# Altium schematic sheet MicroControllerSTM32f103.SchDoc
size A4
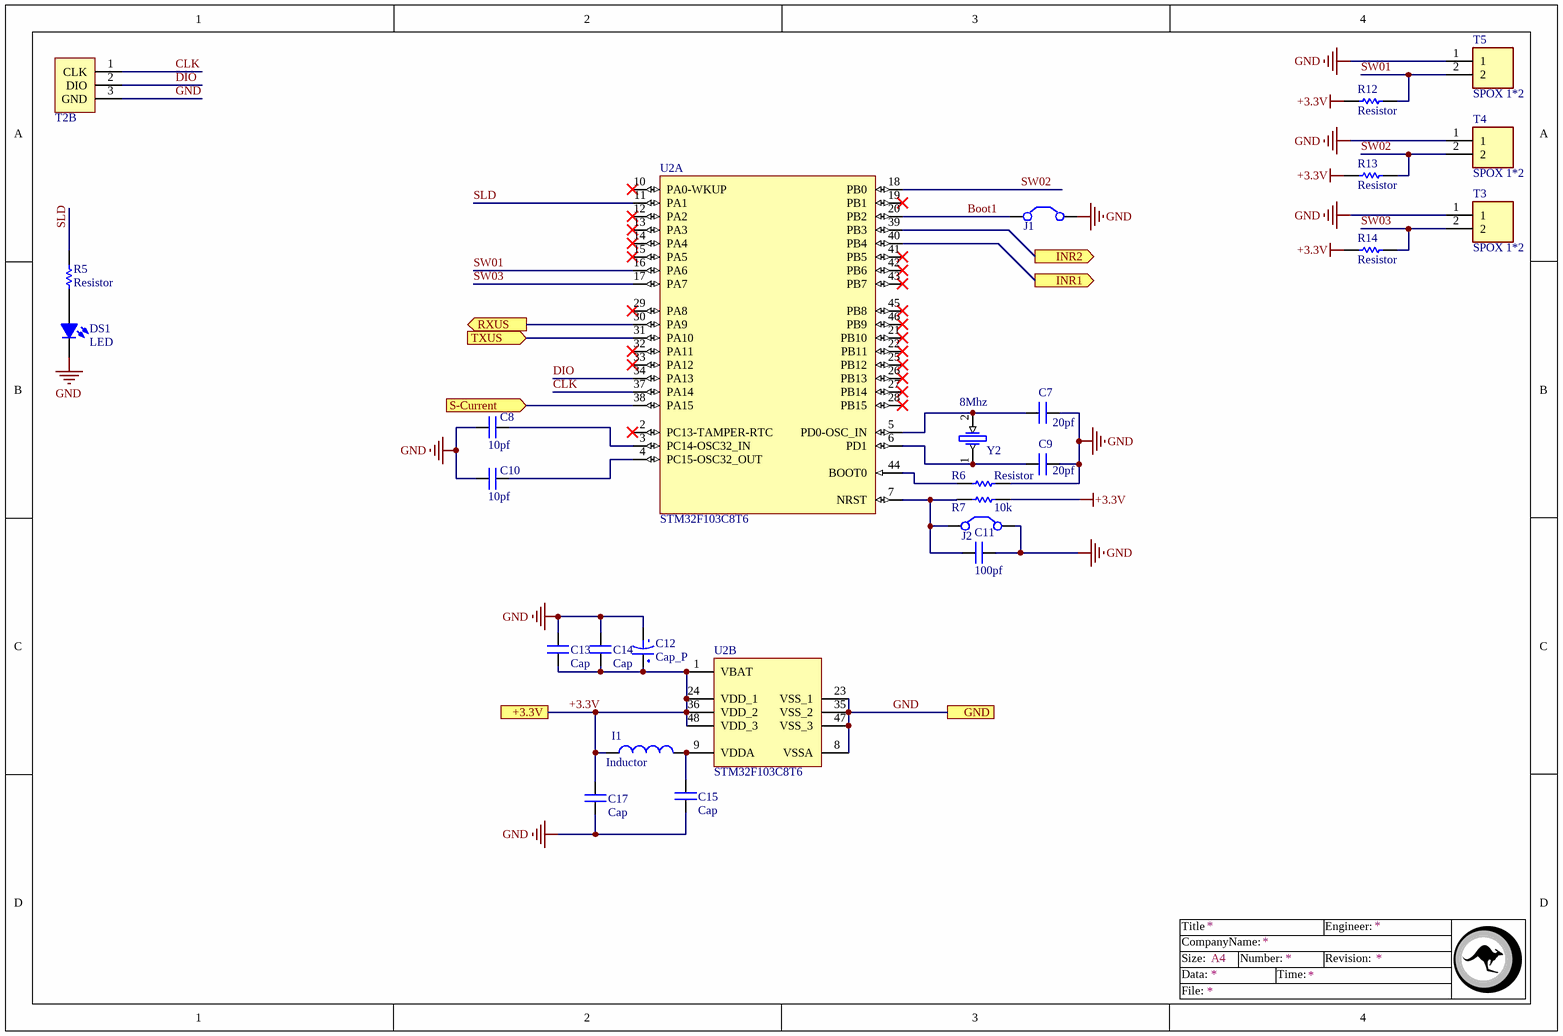
[diagram p0: MicroControllerSTM32f103.SchDoc]

## Parts
C7  20pf  [Cap0805]
C8  10pf  [Cap0805]
C9  20pf  [Cap0805]
C10  10pf  [Cap0805]
C11  100pf  [Cap0805]
C12  Cap_P  [CAPMOL_C]
C13  Cap  [Cap0805]
C14  Cap  [Cap0805]
C15  Cap  [Cap0805]
C17  Cap  [Cap0805]
DS1  LED  [Led0805]
I1  Inductor  [1206]
J1  Jumper  [Jumper SMD - Small]  (value not drawn)
J2  Jumper  [Jumper SMD - Small]  (value not drawn)
R5  Resistor  [R0805]
R6  Resistor  [R0805]
R7  10k  [R0805]
R12  Resistor  [0603]
R13  Resistor  [0603]
R14  Resistor  [0603]
T2  Serial Program  [MHDR1X03-254P - E]  (value not drawn)  (part B of 2)
T3  SPOX 1*2  [SPOX2]
T4  SPOX 1*2  [SPOX2]
T5  SPOX 1*2  [SPOX2]
U2  STM32F103C8T6  [LQFP48_L]  (parts A,B of 2)
Y2  8Mhz  [CrystallB]

## Ports
+3.3V, GND, INR1 (out), INR2 (out), RXUS (out), S-Current (in), TXUS (in)

## Nets
+3.3V: C12.2 C13.1 C14.1 C17.2 I1.1 R7.1 R12.1 R13.1 R14.1 U2.1(VBAT) U2.24(VDD_1) U2.36(VDD_2) U2.48(VDD_3) ; port +3.3V
GND: C7.1 C8.1 C9.1 C10.1 C11.2 C12.1 C13.2 C14.2 C15.1 C17.1 DS1.K J1.2(C2) J2.2(C2) R6.2 T2.3(GND) T3.1 T4.1 T5.1 U2.8(VSSA) U2.23(VSS_1) U2.35(VSS_2) U2.47(VSS_3) ; port GND
Boot1: J1.1(C1) U2.20(PB2)
CLK: T2.1(CLK) U2.37(PA14)
DIO: T2.2(DIO) U2.34(PA13)
INR1: U2.40(PB4) ; port INR1
INR2: U2.39(PB3) ; port INR2
RXUS: U2.30(PA9) ; port RXUS
S-Current: U2.38(PA15) ; port S-Current
SLD: R5.1 U2.11(PA1)
SW01: R12.2 T5.2 U2.16(PA6)
SW02: R13.2 T4.2 U2.18(PB0)
SW03: R14.2 T3.2 U2.17(PA7)
TXUS: U2.31(PA10) ; port TXUS
NetC7_2: C7.2 U2.5(PD0-OSC_IN) Y2.2
NetC8_2: C8.2 U2.3(PC14-OSC32_IN)
NetC9_2: C9.2 U2.6(PD1) Y2.1
NetC10_2: C10.2 U2.4(PC15-OSC32_OUT)
NetC11_1: C11.1 J2.1(C1) R7.2 U2.7(NRST)
NetC15_2: C15.2 I1.2 U2.9(VDDA)
NetDS1_A: DS1.A R5.2
NetR6_1: R6.1 U2.44(BOOT0)

Not connected (* = marked no-connect by the designer): U2 2(PC13-TAMPER-RTC)* 10(PA0-WKUP)* 12(PA2)* 13(PA3)* 14(PA4)* 15(PA5)* 19(PB1)* 21(PB10)* 22(PB11)* 25(PB12)* 26(PB13)* 27(PB14)* 28(PB15)* 29(PA8)* 32(PA11)* 33(PA12)* 41(PB5)* 42(PB6)* 43(PB7)* 45(PB8)* 46(PB9)*

## Notes on the sheet
- Title
- Size:
- Data:
- CompanyName:
- A4
- Number:
- Time:
- Revision:
- Engineer:
- File:

## Library data of the parts
C7-C11 C13-C15 C17 = Cap: Surface mount Capacitor
C12 = Cap_P: Polarity
I1 = Inductor: Indicator
R7 = Resistor
T2 = Serial Program: STM Serial Program pin
U2 = STM32F103C8T6: STM32 ARM-based 32-bit MCU Performance Line with 64 kB Flash, 20 kB Internal RAM, -40 to +85°C Temperature, 48-Pin LQFP, Tray; DatasheetVersion: rev13.0, Apr-2011; PackageVersion: rev13, Apr-2011; PackageReference: LQFP48; PackageDescription: 48-Pin Low-Profile Quad Flat Pack, 7 x 7 mm Body, 0.5 mm Pitch (LQFP48); ComponentLink1Description: Manufacturer URL; ComponentLink1URL: http://www.st.com/; ComponentLink2Description: STM32F103 Datasheet; ComponentLink2URL: http://www.st.com/internet/com/TECHNICAL_RESOURCES/TECHNICAL_LITERATURE/DATASHEET/CD00161566.pdf; ComponentLink3Description: STM32 Family Web Page; ComponentLink3URL: www.st.com/stm32
Y2 = Crystal